# EAGLE schematic Passive_KLine (EAGLE 9.5.1)
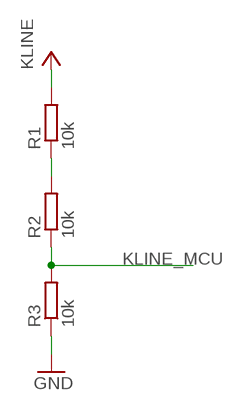
[diagram p0: schematic, sheet 1]

## Parts
R1  10k  R-EU_R1206  [R1206]
R2  10k  R-EU_R1206  [R1206]
R3  10k  R-EU_R1206  [R1206]

## Nets
GND: R3.1
KLINE_MCU: R2.1 R3.2
N$1: R1.1 R2.2
VCC: R1.2 ; supply symbol labelled KLINE

## Library data of the parts
R1-R3 = rcl:R-EU_: RESISTOR, European symbol; SPICEPREFIX: R